# Altium schematic sheet PCD-disc-schematic.SchDoc
size A; SheetNumber: 1; SheetTotal: 1
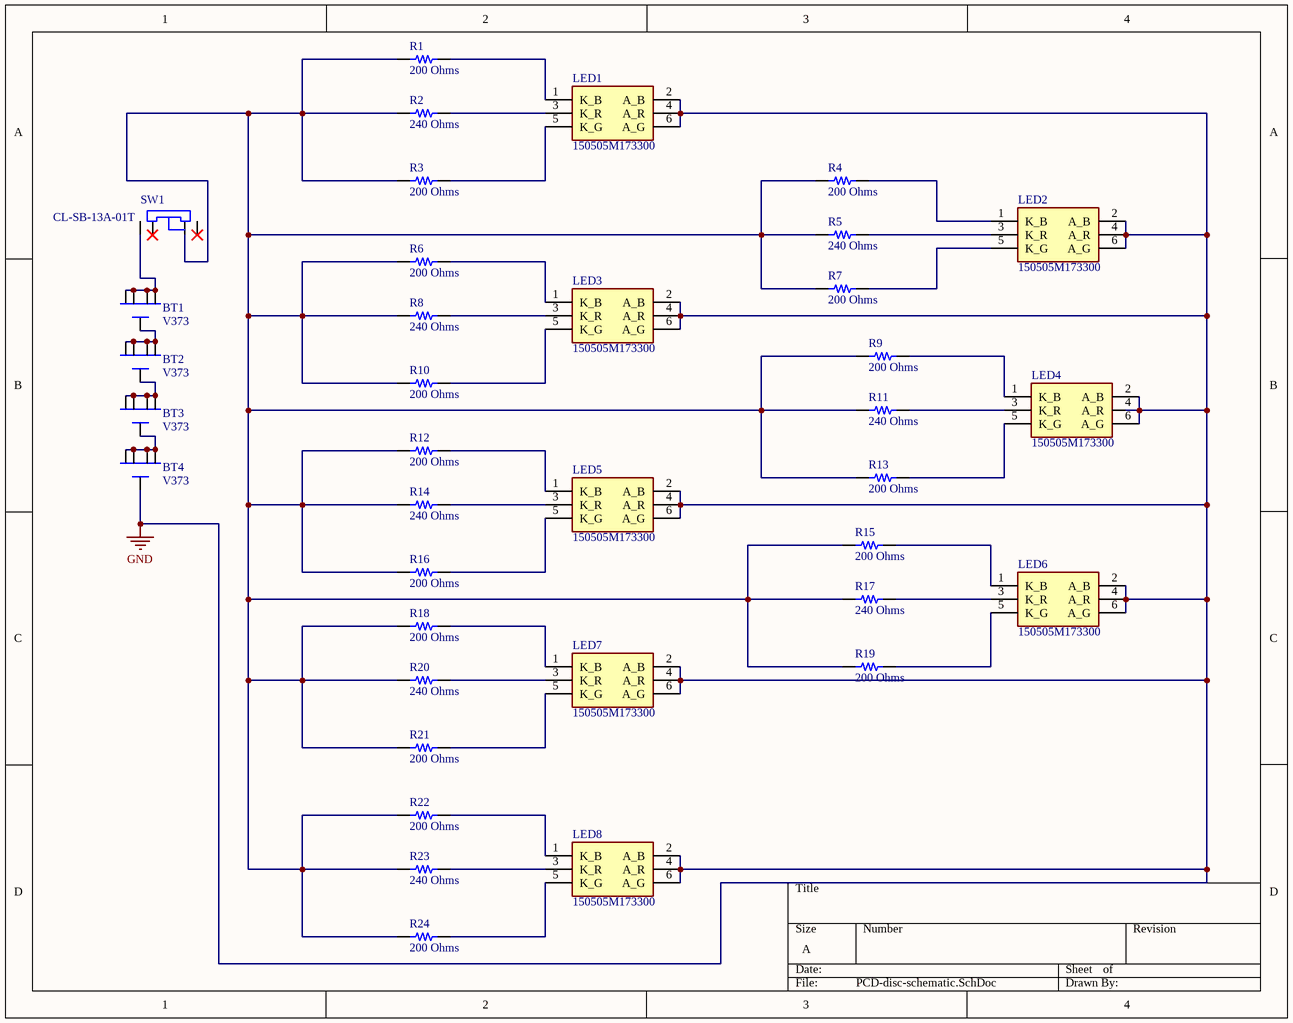
[diagram p0: PCD-disc-schematic.SchDoc]

## Parts
BT1  V373  [V373]
BT2  V373  [V373]
BT3  V373  [V373]
BT4  V373  [V373]
LED1  150505M173300  [150505M173300]
LED2  150505M173300  [150505M173300]
LED3  150505M173300  [150505M173300]
LED4  150505M173300  [150505M173300]
LED5  150505M173300  [150505M173300]
LED6  150505M173300  [150505M173300]
LED7  150505M173300  [150505M173300]
LED8  150505M173300  [150505M173300]
R1  200 Ohms  [RES 0603_1608]
R2  240 Ohms  [RES 0603_1608]
R3  200 Ohms  [RES 0603_1608]
R4  200 Ohms  [RES 0603_1608]
R5  240 Ohms  [RES 0603_1608]
R6  200 Ohms  [RES 0603_1608]
R7  200 Ohms  [RES 0603_1608]
R8  240 Ohms  [RES 0603_1608]
R9  200 Ohms  [RES 0603_1608]
R10  200 Ohms  [RES 0603_1608]
R11  240 Ohms  [RES 0603_1608]
R12  200 Ohms  [RES 0603_1608]
R13  200 Ohms  [RES 0603_1608]
R14  240 Ohms  [RES 0603_1608]
R15  200 Ohms  [RES 0603_1608]
R16  200 Ohms  [RES 0603_1608]
R17  240 Ohms  [RES 0603_1608]
R18  200 Ohms  [RES 0603_1608]
R19  200 Ohms  [RES 0603_1608]
R20  240 Ohms  [RES 0603_1608]
R21  200 Ohms  [RES 0603_1608]
R22  200 Ohms  [RES 0603_1608]
R23  240 Ohms  [RES 0603_1608]
R24  200 Ohms  [RES 0603_1608]
SW1  CL-SB-13A-01T  [CL-SB-13A-01T]

## Nets
GND: BT4.5 LED1.2(A_B) LED1.4(A_R) LED1.6(A_G) LED2.2(A_B) LED2.4(A_R) LED2.6(A_G) LED3.2(A_B) LED3.4(A_R) LED3.6(A_G) LED4.2(A_B) LED4.4(A_R) LED4.6(A_G) LED5.2(A_B) LED5.4(A_R) LED5.6(A_G) LED6.2(A_B) LED6.4(A_R) LED6.6(A_G) LED7.2(A_B) LED7.4(A_R) LED7.6(A_G) LED8.2(A_B) LED8.4(A_R) LED8.6(A_G)
NetBT1_1: BT1.1 BT1.2 BT1.3 BT1.4 SW1.1
NetBT1_5: BT1.5 BT2.1 BT2.2 BT2.3 BT2.4
NetBT2_5: BT2.5 BT3.1 BT3.2 BT3.3 BT3.4
NetBT3_5: BT3.5 BT4.1 BT4.2 BT4.3 BT4.4
NetLED1_1: LED1.1(K_B) R1.2
NetLED1_3: LED1.3(K_R) R2.2
NetLED1_5: LED1.5(K_G) R3.2
NetLED2_1: LED2.1(K_B) R4.2
NetLED2_3: LED2.3(K_R) R5.2
NetLED2_5: LED2.5(K_G) R7.2
NetLED3_1: LED3.1(K_B) R6.2
NetLED3_3: LED3.3(K_R) R8.2
NetLED3_5: LED3.5(K_G) R10.2
NetLED4_1: LED4.1(K_B) R9.2
NetLED4_3: LED4.3(K_R) R11.2
NetLED4_5: LED4.5(K_G) R13.2
NetLED5_1: LED5.1(K_B) R12.2
NetLED5_3: LED5.3(K_R) R14.2
NetLED5_5: LED5.5(K_G) R16.2
NetLED6_1: LED6.1(K_B) R15.2
NetLED6_3: LED6.3(K_R) R17.2
NetLED6_5: LED6.5(K_G) R19.2
NetLED7_1: LED7.1(K_B) R18.2
NetLED7_3: LED7.3(K_R) R20.2
NetLED7_5: LED7.5(K_G) R21.2
NetLED8_1: LED8.1(K_B) R22.2
NetLED8_3: LED8.3(K_R) R23.2
NetLED8_5: LED8.5(K_G) R24.2
NetR1_1: R1.1 R2.1 R3.1 R4.1 R5.1 R6.1 R7.1 R8.1 R9.1 R10.1 R11.1 R12.1 R13.1 R14.1 R15.1 R16.1 R17.1 R18.1 R19.1 R20.1 R21.1 R22.1 R23.1 R24.1 SW1.3

Not connected (* = marked no-connect by the designer): SW1 2* 4*

## Library data of the parts
LED1-LED8 = 150505M173300: LED; Manufacturer_Name: Wurth Elektronik; Datasheet Link: https://katalog.we-online.de/led/datasheet/150505M173300.pdf; Height: 1.8mm; Manufacturer_Part_Number: 150505M173300; Mouser Part Number: 710-150505M173300; Mouser Price/Stock: https://www.mouser.co.uk/ProductDetail/Wurth-Elektronik/150505M173300?qs=fAHHVMwC%252Bbi%2FURn4Qu0%2FAA%3D%3D
R1 R3 R4 R6 R7 R9 R10 R12 R13 R15 R16 R18 R19 R21 R22 R24 = CRCW0603200RFKEAC: RES 200 OHM 1% 1/10W 0603; Manufacturer: Vishay Dale; Power (Watts): 0.1W, 1/10W; Temperature Coefficient: ±100ppm/°C; Part Number: CRCW0603200RFKEAC; Value: 200 Ohms; ComponentLink1Description: Datasheet; ComponentLink1URL: http://www.vishay.com/docs/28773/crcwce3.pdf; ComponentLink2Description: DigiKey Link; ComponentLink2URL: https://www.digikey.com/en/products/detail/vishay-dale/CRCW0603200RFKEAC/7928457; Composition: Thick Film; Device Package: 0603 (1608 Metric); Height - Seated (Max): 0.022" (0.55mm); LastUpdated: 9/19/2022 1:22:05 PM; Lifecycle Status: Active; Minimum Order: 1; Number of Terminations: 2; Operating Temperature: -55°C ~ 155°C; Package / Case: 0603 (1608 Metric); Packaging: CutTape; PartId: 12623; Part Status: Active; Price: 0.01; Resistance: 200 Ohms; Series: CRCW-C; Supplier 1: DigiKey; Supplier Part Number 1: 541-4035-1-ND; Supplier Device Package: 0603; Tolerance: ±1%
R2 R5 R8 R11 R14 R17 R20 R23 = RMCF0603FT240R: RES 240 OHM 1% 1/10W 0603; Manufacturer: Stackpole Electronics Inc; Power (Watts): 0.1W, 1/10W; Temperature Coefficient: ±100ppm/°C; Part Number: RMCF0603FT240R; Value: 240 Ohms; ComponentLink1Description: Datasheet; ComponentLink1URL: https://www.seielect.com/catalog/sei-rmcf_rmcp.pdf; ComponentLink2Description: DigiKey Link; ComponentLink2URL: https://www.digikey.com/en/products/detail/stackpole-electronics-inc/RMCF0603FT240R/1713818; Composition: Thick Film; Device Package: 0603 (1608 Metric); Features: Automotive AEC-Q200; Height - Seated (Max): 0.022" (0.55mm); LastUpdated: 9/19/2022 1:22:12 PM; Lifecycle Status: Active; Minimum Order: 1; Number of Terminations: 2; Operating Temperature: -55°C ~ 155°C; Package / Case: 0603 (1608 Metric); Packaging: CutTape; PartId: 10745; Part Status: Active; Price: 0.01; Ratings: AEC-Q200; Resistance: 240 Ohms; Series: RMCF; Size / Dimension: 0.061" L x 0.031" W (1.55mm x 0.80mm); Supplier 1: DigiKey; Supplier Part Number 1: 738-RMCF0603FT240RCT-ND; Supplier Device Package: 0603; Tolerance: ±1%
SW1 = CL-SB-13A-01T: SWITCH SLIDE SP3T 200MA 12V; Supplier 1: Digi-Key; Supplier Part Number 1: 563-1326-1-ND